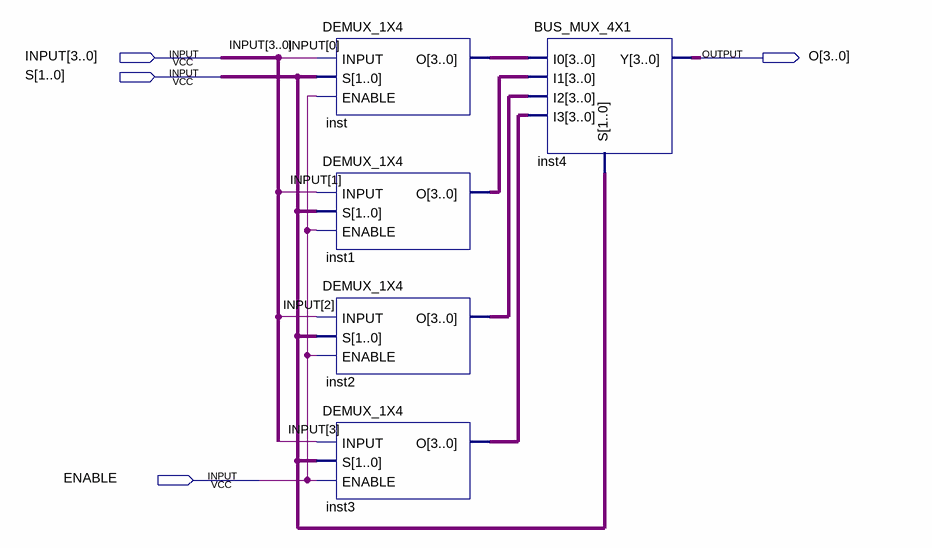
[diagram p0: schematic sheet]
// Quartus schematic BUS_DEMUX_1X4.bdf as structural Verilog: 5 symbols, 4 pins
module BUS_DEMUX_1X4 (
  input  [3:0] INPUT,
  input  [1:0] S,
  input  ENABLE,
  output [3:0] O
);

  wire [3:0] inst1_o, inst2_o, inst3_o, inst_o;

  DEMUX_1X4 inst (.INPUT(INPUT[0]), .S(S), .ENABLE(ENABLE), .O(inst_o));
  DEMUX_1X4 inst1 (.INPUT(INPUT[1]), .S(S), .ENABLE(ENABLE), .O(inst1_o));
  DEMUX_1X4 inst2 (.INPUT(INPUT[2]), .S(S), .ENABLE(ENABLE), .O(inst2_o));
  DEMUX_1X4 inst3 (.INPUT(INPUT[3]), .S(S), .ENABLE(ENABLE), .O(inst3_o));
  BUS_MUX_4X1 inst4 (.I0(inst_o), .I1(inst1_o), .I2(inst2_o), .I3(inst3_o), .S(S), .Y(O));
endmodule
